# Altium schematic sheet Comparator.SchDoc
size A
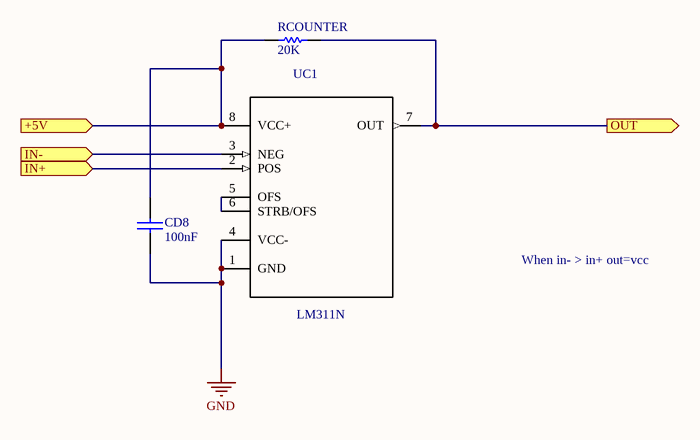
[diagram p0: Comparator.SchDoc]

## Parts
CD8  100nF  [0805]
RCOUNTER  20K  [0805]
UC1  LM311N  [*DIP254P762X480-8]

## Ports
+5V (in), IN+ (in), IN- (in), OUT (out)

## Nets
GND: CD8.2 UC1.1(GND) UC1.4(VCC-)
+5V: CD8.1 RCOUNTER.1 UC1.8(VCC+) ; port +5V
IN+: UC1.2(POS) ; port IN+
IN-: UC1.3(NEG) ; port IN-
OUT: RCOUNTER.2 UC1.7(OUT) ; port OUT
NetUC1_5: UC1.5(OFS) UC1.6(STRB/OFS)

## Notes on the sheet
- When in- > in+ out=vcc

## Library data of the parts
CD8 = CAP
RCOUNTER = RES
UC1 = LM311N: IC VOLTAGE COMPARATOR 8-DIP; MF: Texas Instruments; Package: DIP-8 AMD; Availability: Unavailable; MP: LM311N; SnapEDA_Link: https://www.snapeda.com/parts/LM311N/Texas%20Instruments/view-part/?ref=snap; Price: None; Value: *